# Altium project e-puck3-motor_dev.PrjPcb (part 2 of 2)
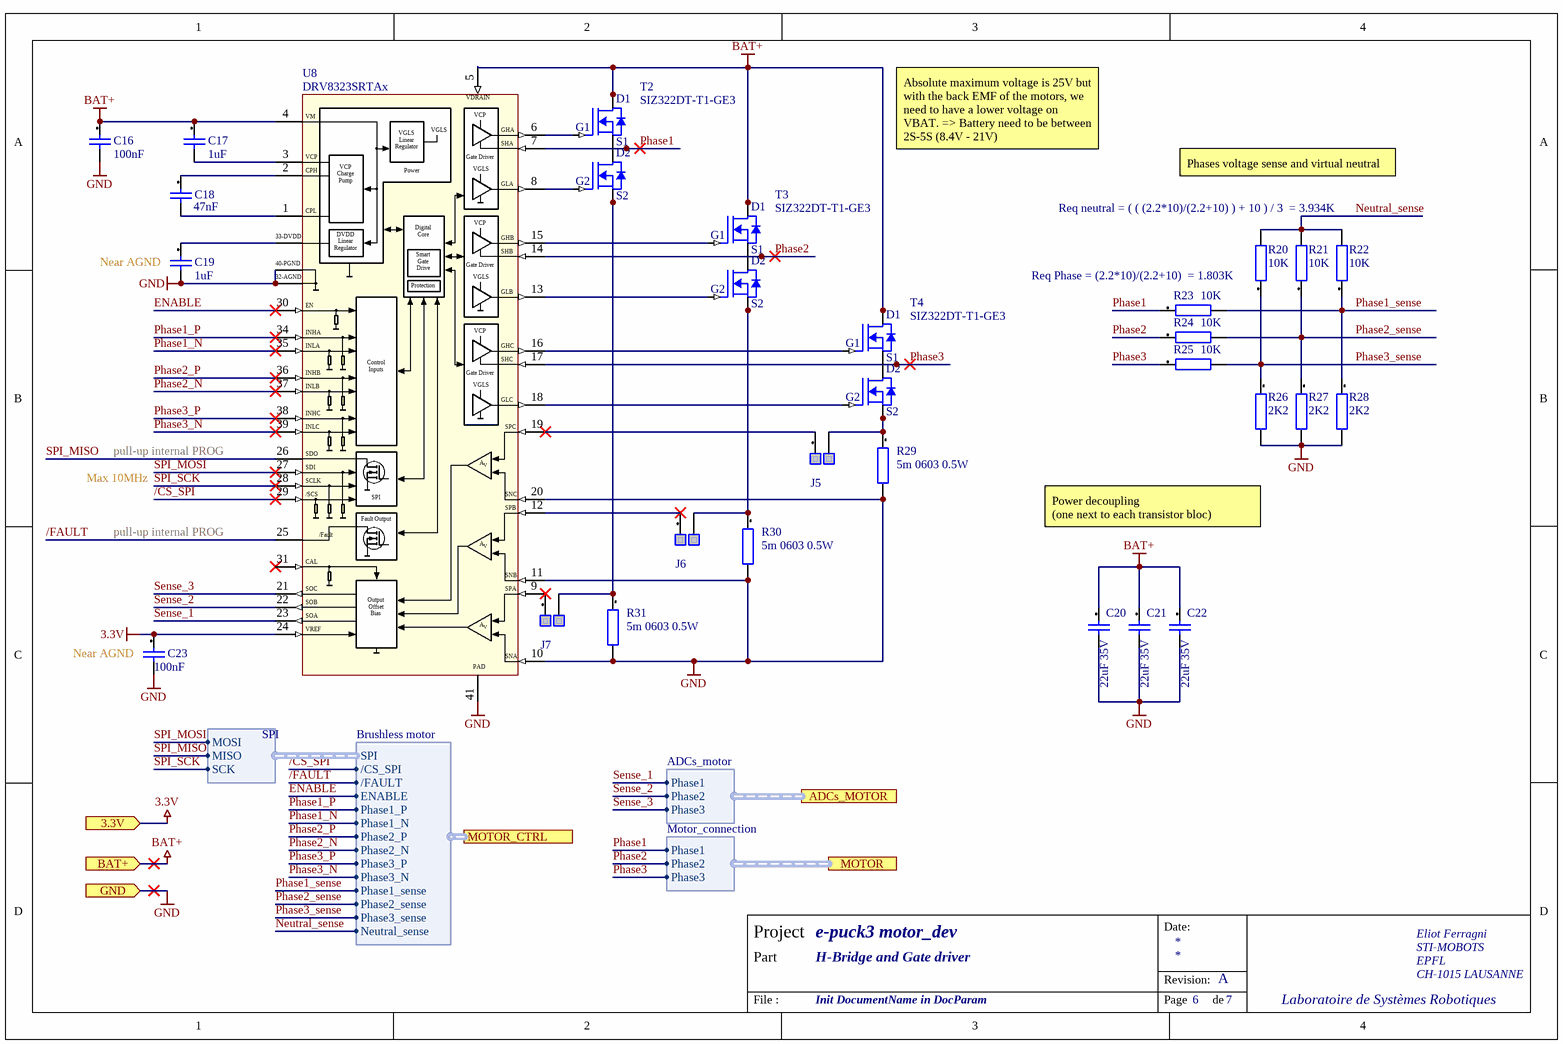
[diagram p7: ESC_2S-5S.SchDoc]

## Nets that join several sheets
3.3V: Programmer (8 pins), Power (6 pins), USB (5 pins), Leds (D1.1 D2.1 D3.1), Encoders (9 pins), U1_ESC_2S-5S (C23_1.1 U8_1.24), U2_ESC_2S-5S (C23_2.1 U8_2.24), U3_ESC_2S-5S (C23_3.1 U8_3.24), U4_ESC_2S-5S (C23_4.1 U8_4.24)
BAT+: Power (C12.1 D5.2 P11.1 U3.2), U1_ESC_2S-5S (19 pins), U2_ESC_2S-5S (19 pins), U3_ESC_2S-5S (19 pins), U4_ESC_2S-5S (19 pins)
GND: Programmer (32 pins), Power (21 pins), USB (11 pins), Encoders (10 pins), U1_ESC_2S-5S (18 pins), U2_ESC_2S-5S (18 pins), U3_ESC_2S-5S (18 pins), U4_ESC_2S-5S (18 pins)
VBUS: Power (D6.2 P4.1 R13.1 U3.7), USB (6 pins)
/CS_ENCODERS: Programmer (P14.41), Encoders (R34.2 U9.4 U10.4)
/INT_ENCODERS: Programmer (P14.40), Encoders (U9.15)
/INT_PD_CTRL: Programmer (P14.70), USB (U2.5)
/PWR_ON_BTN_STATE: Programmer (P15.52), Power (D7.2)
ADCs_motor.Phase1: Main (P1.2 P2.2 P3.2), Programmer (P15.24)
ADCs_motor.Phase2: Main (P1.4 P2.4 P3.4), Programmer (P15.34)
ADCs_motor.Phase3: Main (P1.6 P2.6 P3.6), Programmer (P15.6)
ADCs_MOTOR_2.Phase1: Main (P1.1), U2_ESC_2S-5S (U8_2.23)
ADCs_MOTOR_2.Phase2: Main (P1.3), U2_ESC_2S-5S (U8_2.22)
ADCs_MOTOR_2.Phase3: Main (P1.5), U2_ESC_2S-5S (U8_2.21)
ADCs_MOTOR_3.Phase1: Main (P2.1), U3_ESC_2S-5S (U8_3.23)
ADCs_MOTOR_3.Phase2: Main (P2.3), U3_ESC_2S-5S (U8_3.22)
ADCs_MOTOR_3.Phase3: Main (P2.5), U3_ESC_2S-5S (U8_3.21)
ADCs_MOTOR_4.Phase1: Main (P3.1), U4_ESC_2S-5S (U8_4.23)
ADCs_MOTOR_4.Phase2: Main (P3.3), U4_ESC_2S-5S (U8_4.22)
ADCs_MOTOR_4.Phase3: Main (P3.5), U4_ESC_2S-5S (U8_4.21)
I2C_PD_CTRL.SCL: Programmer (P14.51), USB (R11.2 U2.6)
I2C_PD_CTRL.SDA: Programmer (P14.53), USB (R10.2 U2.7)
MOTOR_1.Phase1: Programmer (U7.1 U7.2), U1_ESC_2S-5S (R23_1.1 T2_1.9 U8_1.7)
MOTOR_1.Phase2: Programmer (U6.1 U6.2), U1_ESC_2S-5S (R24_1.1 T3_1.9 U8_1.14)
MOTOR_1.Phase3: Programmer (U5.1 U5.2), U1_ESC_2S-5S (R25_1.1 T4_1.9 U8_1.17)
MOTOR_2.Phase1: Programmer (P16.1 P21.1 P24.6 P24.7), U2_ESC_2S-5S (R23_2.1 T2_2.9 U8_2.7)
MOTOR_2.Phase2: Programmer (P16.2 P21.2 P24.8 P24.9), U2_ESC_2S-5S (R24_2.1 T3_2.9 U8_2.14)
MOTOR_2.Phase3: Programmer (P16.3 P21.3 P24.10 P24.11), U2_ESC_2S-5S (R25_2.1 T4_2.9 U8_2.17)
MOTOR_3.Phase1: Programmer (P17.1 P22.1 P25.6 P25.7), U3_ESC_2S-5S (R23_3.1 T2_3.9 U8_3.7)
MOTOR_3.Phase2: Programmer (P17.2 P22.2 P25.8 P25.9), U3_ESC_2S-5S (R24_3.1 T3_3.9 U8_3.14)
MOTOR_3.Phase3: Programmer (P17.3 P22.3 P25.10 P25.11), U3_ESC_2S-5S (R25_3.1 T4_3.9 U8_3.17)
MOTOR_4.Phase1: Programmer (P18.1 P23.1 P26.6 P26.7), U4_ESC_2S-5S (R23_4.1 T2_4.9 U8_4.7)
MOTOR_4.Phase2: Programmer (P18.2 P23.2 P26.8 P26.9), U4_ESC_2S-5S (R24_4.1 T3_4.9 U8_4.14)
MOTOR_4.Phase3: Programmer (P18.3 P23.3 P26.10 P26.11), U4_ESC_2S-5S (R25_4.1 T4_4.9 U8_4.17)
MOTOR_CTRL_1./CS_SPI: Programmer (P14.39), U1_ESC_2S-5S (U8_1.29)
MOTOR_CTRL_1./FAULT: Programmer (P15.59), U1_ESC_2S-5S (U8_1.25)
MOTOR_CTRL_1.ENABLE: Programmer (P15.16), U1_ESC_2S-5S (U8_1.30)
MOTOR_CTRL_1.Neutral_sense: Programmer (J1.1), U1_ESC_2S-5S (R20_1.2 R21_1.2 R22_1.2)
MOTOR_CTRL_1.Phase1_N: Programmer (P15.30), U1_ESC_2S-5S (U8_1.35)
MOTOR_CTRL_1.Phase1_P: Programmer (P15.23), U1_ESC_2S-5S (U8_1.34)
MOTOR_CTRL_1.Phase1_sense: Programmer (P14.28), U1_ESC_2S-5S (R22_1.1 R23_1.2 R28_1.1)
MOTOR_CTRL_1.Phase2_N: Programmer (P15.47), U1_ESC_2S-5S (U8_1.37)
MOTOR_CTRL_1.Phase2_P: Programmer (P15.56), U1_ESC_2S-5S (U8_1.36)
MOTOR_CTRL_1.Phase2_sense: Programmer (P14.30), U1_ESC_2S-5S (R21_1.1 R24_1.2 R27_1.1)
MOTOR_CTRL_1.Phase3_N: Programmer (P15.49), U1_ESC_2S-5S (U8_1.39)
MOTOR_CTRL_1.Phase3_P: Programmer (P15.33), U1_ESC_2S-5S (U8_1.38)
MOTOR_CTRL_1.Phase3_sense: Programmer (P15.35), U1_ESC_2S-5S (R20_1.1 R25_1.2 R26_1.1)
MOTOR_CTRL_2./CS_SPI: Programmer (P14.45), U2_ESC_2S-5S (U8_2.29)
MOTOR_CTRL_2./FAULT: Programmer (P15.57), U2_ESC_2S-5S (U8_2.25)
MOTOR_CTRL_2.ENABLE: Programmer (P15.55), U2_ESC_2S-5S (U8_2.30)
MOTOR_CTRL_2.Neutral_sense: Programmer (J2.1), U2_ESC_2S-5S (R20_2.2 R21_2.2 R22_2.2)
MOTOR_CTRL_2.Phase1_N: Programmer (P15.31), U2_ESC_2S-5S (U8_2.35)
MOTOR_CTRL_2.Phase1_P: Programmer (P14.17), U2_ESC_2S-5S (U8_2.34)
MOTOR_CTRL_2.Phase1_sense: Programmer (P14.9), U2_ESC_2S-5S (R22_2.1 R23_2.2 R28_2.1)
MOTOR_CTRL_2.Phase2_N: Programmer (P15.18), U2_ESC_2S-5S (U8_2.37)
MOTOR_CTRL_2.Phase2_P: Programmer (P15.25), U2_ESC_2S-5S (U8_2.36)
MOTOR_CTRL_2.Phase2_sense: Programmer (P14.11), U2_ESC_2S-5S (R21_2.1 R24_2.2 R27_2.1)
MOTOR_CTRL_2.Phase3_N: Programmer (P15.29), U2_ESC_2S-5S (U8_2.39)
MOTOR_CTRL_2.Phase3_P: Programmer (P15.27), U2_ESC_2S-5S (U8_2.38)
MOTOR_CTRL_2.Phase3_sense: Programmer (P14.54), U2_ESC_2S-5S (R20_2.1 R25_2.2 R26_2.1)
MOTOR_CTRL_3./CS_SPI: Programmer (P15.65), U3_ESC_2S-5S (U8_3.29)
MOTOR_CTRL_3./FAULT: Programmer (P15.50), U3_ESC_2S-5S (U8_3.25)
MOTOR_CTRL_3.ENABLE: Programmer (P15.51), U3_ESC_2S-5S (U8_3.30)
MOTOR_CTRL_3.Neutral_sense: Programmer (J3.1), U3_ESC_2S-5S (R20_3.2 R21_3.2 R22_3.2)
MOTOR_CTRL_3.Phase1_N: Programmer (P15.1), U3_ESC_2S-5S (U8_3.35)
MOTOR_CTRL_3.Phase1_P: Programmer (P14.34), U3_ESC_2S-5S (U8_3.34)
MOTOR_CTRL_3.Phase1_sense: Programmer (P15.42), U3_ESC_2S-5S (R22_3.1 R23_3.2 R28_3.1)
MOTOR_CTRL_3.Phase2_N: Programmer (P15.41), U3_ESC_2S-5S (U8_3.37)
MOTOR_CTRL_3.Phase2_P: Programmer (P15.43), U3_ESC_2S-5S (U8_3.36)
MOTOR_CTRL_3.Phase2_sense: Programmer (P15.58), U3_ESC_2S-5S (R21_3.1 R24_3.2 R27_3.1)
MOTOR_CTRL_3.Phase3_N: Programmer (P15.5), U3_ESC_2S-5S (U8_3.39)
MOTOR_CTRL_3.Phase3_P: Programmer (P15.46), U3_ESC_2S-5S (U8_3.38)
MOTOR_CTRL_3.Phase3_sense: Programmer (P14.38), U3_ESC_2S-5S (R20_3.1 R25_3.2 R26_3.1)
MOTOR_CTRL_4./CS_SPI: Programmer (P15.45), U4_ESC_2S-5S (U8_4.29)
MOTOR_CTRL_4./FAULT: Programmer (P15.60), U4_ESC_2S-5S (U8_4.25)
MOTOR_CTRL_4.ENABLE: Programmer (P15.53), U4_ESC_2S-5S (U8_4.30)
MOTOR_CTRL_4.Neutral_sense: Programmer (J4.1), U4_ESC_2S-5S (R20_4.2 R21_4.2 R22_4.2)
MOTOR_CTRL_4.Phase1_N: Programmer (P15.15), U4_ESC_2S-5S (U8_4.35)
MOTOR_CTRL_4.Phase1_P: Programmer (P15.4), U4_ESC_2S-5S (U8_4.34)
MOTOR_CTRL_4.Phase1_sense: Programmer (P14.35), U4_ESC_2S-5S (R22_4.1 R23_4.2 R28_4.1)
MOTOR_CTRL_4.Phase2_N: Programmer (P15.28), U4_ESC_2S-5S (U8_4.37)
MOTOR_CTRL_4.Phase2_P: Programmer (P15.19), U4_ESC_2S-5S (U8_4.36)
MOTOR_CTRL_4.Phase2_sense: Programmer (P14.37), U4_ESC_2S-5S (R21_4.1 R24_4.2 R27_4.1)
MOTOR_CTRL_4.Phase3_N: Programmer (P15.26), U4_ESC_2S-5S (U8_4.39)
MOTOR_CTRL_4.Phase3_P: Programmer (P15.2), U4_ESC_2S-5S (U8_4.38)
MOTOR_CTRL_4.Phase3_sense: Programmer (P15.38), U4_ESC_2S-5S (R20_4.1 R25_4.2 R26_4.1)
PP_STATE: Programmer (P14.66), Power (R14.2 U3.9)
PWR_ON_DFU: Programmer (P14.7 SW2.1), Power (R19.1 T1.5)
PWR_ON_PRG: Programmer (P14.65), Power (R18.1 T1.2)
SPI_BUS.MISO: Programmer (P14.2), Encoders (U10.2), U1_ESC_2S-5S (U8_1.26), U2_ESC_2S-5S (U8_2.26), U3_ESC_2S-5S (U8_3.26), U4_ESC_2S-5S (U8_4.26)
SPI_BUS.MOSI: Programmer (P14.43), Encoders (U9.1), U1_ESC_2S-5S (U8_1.27), U2_ESC_2S-5S (U8_2.27), U3_ESC_2S-5S (U8_3.27), U4_ESC_2S-5S (U8_4.27)
SPI_BUS.SCK: Programmer (P14.1), Encoders (U9.3 U10.3), U1_ESC_2S-5S (U8_1.28), U2_ESC_2S-5S (U8_2.28), U3_ESC_2S-5S (U8_3.28), U4_ESC_2S-5S (U8_4.28)
STATUS1_RGB.B: Programmer (P14.42), Leds (R3.1)
STATUS1_RGB.G: Programmer (P14.58), Leds (R2.1)
STATUS1_RGB.R: Programmer (P14.59), Leds (R1.1)
STATUS2_RGB.B: Programmer (P15.68), Leds (R6.1)
STATUS2_RGB.G: Programmer (P15.69), Leds (R5.1)
STATUS2_RGB.R: Programmer (P14.44), Leds (R4.1)
STATUS3_RGB.B: Programmer (P15.66), Leds (R9.1)
STATUS3_RGB.G: Programmer (P15.67), Leds (R8.1)
STATUS3_RGB.R: Programmer (P15.70), Leds (R7.1)